# EAGLE design Lap Counter (EAGLE 9.6.2)
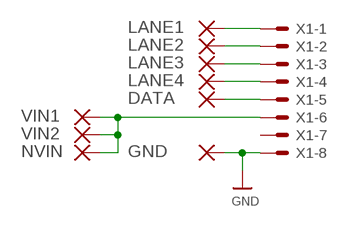
[diagram p0: schematic, sheet 1]

## Parts
DATA  SMD5  [SMD2,54-5,08]
GND  SMD5  [SMD2,54-5,08]
LANE1  SMD5  [SMD2,54-5,08]
LANE2  SMD5  [SMD2,54-5,08]
LANE3  SMD5  [SMD2,54-5,08]
LANE4  SMD5  [SMD2,54-5,08]
NVIN  SMD5  [SMD2,54-5,08]
VIN1  SMD5  [SMD2,54-5,08]
VIN2  SMD5  [SMD2,54-5,08]
X1  KK-156-8  [KK-156-8]

## Nets
DATA: DATA.1(P) X1.5
GND: GND.1(P) X1.8
LANE1: LANE1.1(P) X1.1
LANE2: LANE2.1(P) X1.2
LANE3: LANE3.1(P) X1.3
LANE4: LANE4.1(P) X1.4
VIN: NVIN.1(P) VIN1.1(P) VIN2.1(P) X1.6
Unconnected: X1.7

## Library data of the parts
DATA GND LANE1-LANE4 NVIN VIN1 VIN2 = wirepad:SMD5: SMD PAD
X1 = con-molex:KK-156-8: KK 156 HEADER Source: http://www.molex.com/pdm_docs/sd/026604100_sd.pdf; MF: MOLEX; OC_FARNELL: unknown; OC_NEWARK: unknown

## Board
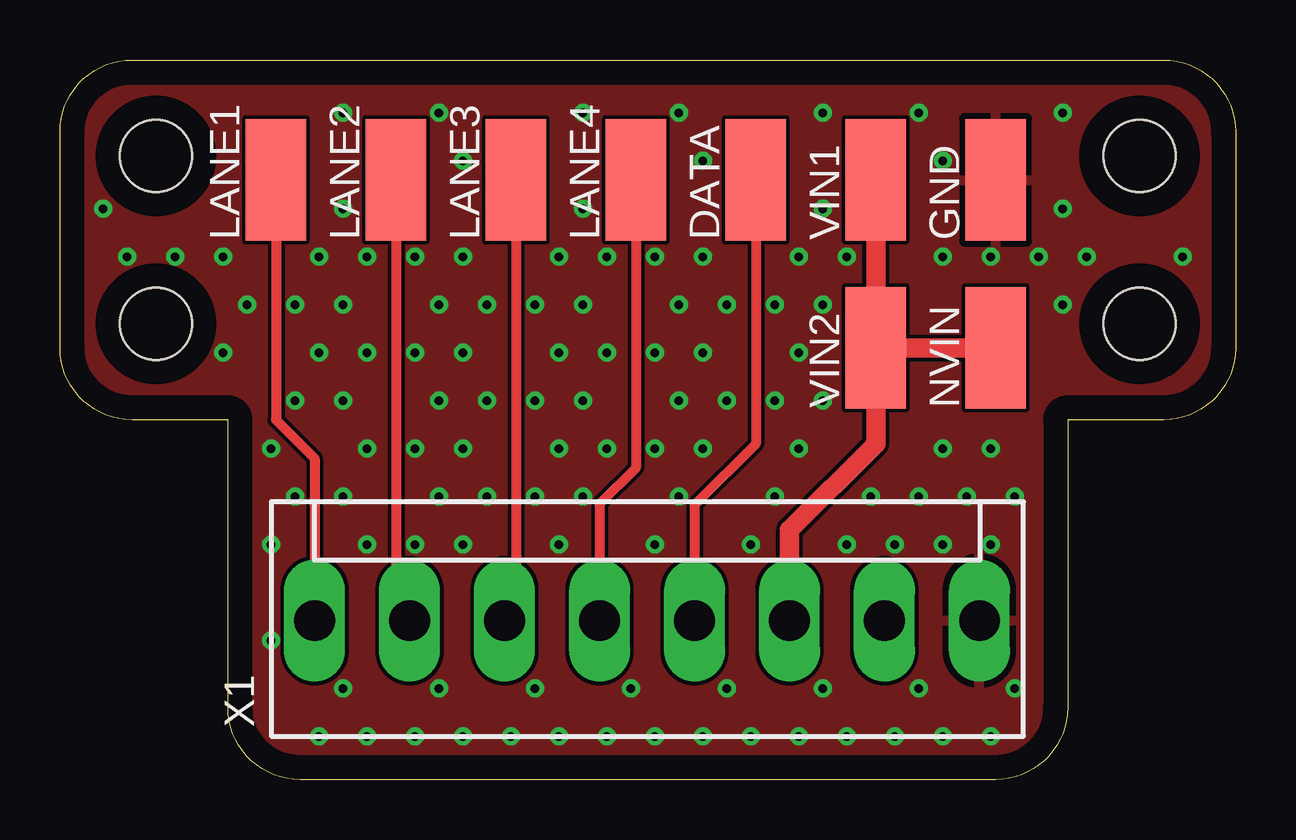
[diagram p1: board, top side]
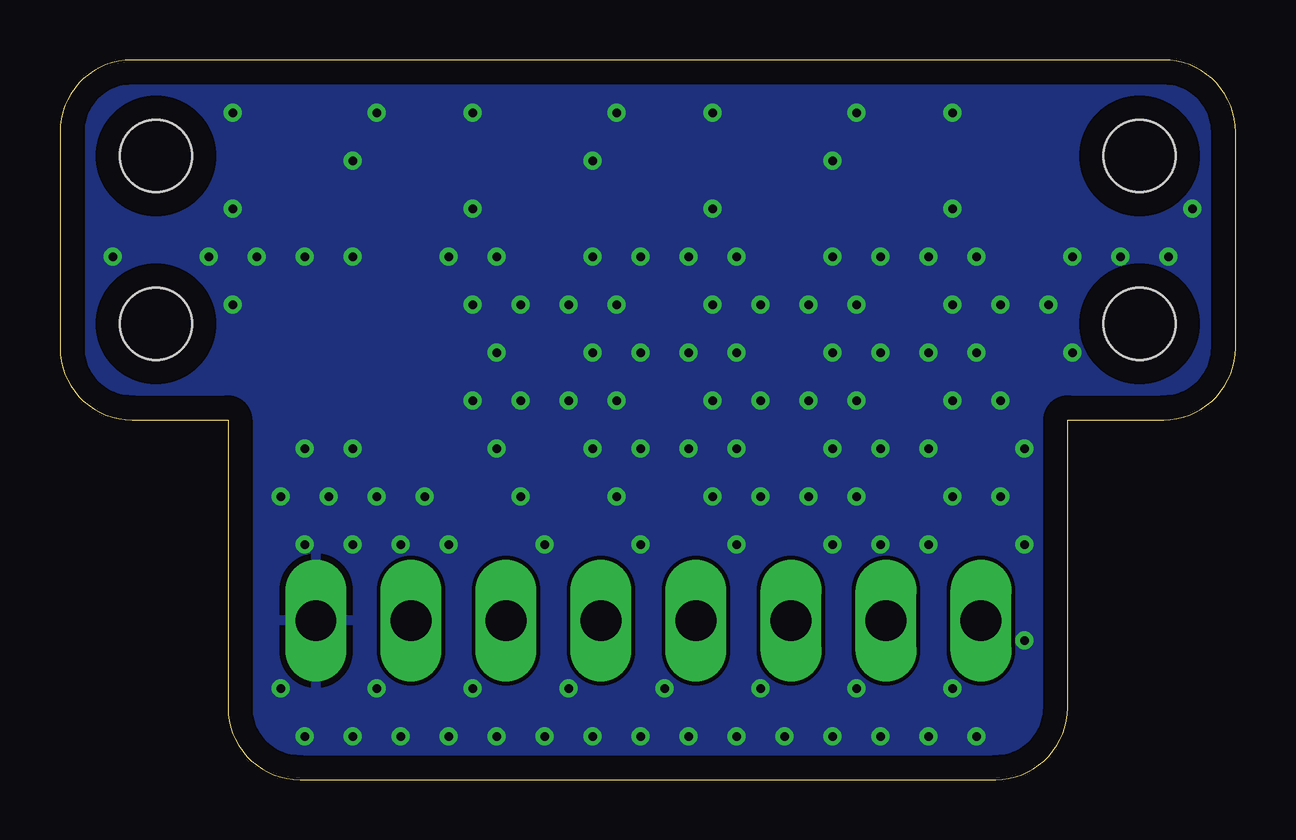
[diagram p2: board, bottom side, seen from below]

Size 49 x 30 mm. Coordinates in mm from the lower left corner, seen from the top.
Outline: 7,15 3,15 arc-90 0,18 0,27 arc-90 3,30 46,30 arc-90 49,27 49,18 arc-90 46,15 42,15 42,3 arc-90 39,0 10,0 arc-90 7,3 7,15
Copper layers (1*16): Top 0.035mm / dielectric 1.5mm / Bottom 0.035mm
Design rules "default": minimum track width 6mil, minimum drill 0.35mm, track to track 6mil, track to pad 6mil, pad to pad 6mil, via to via 6mil, smd to smd 6mil, copper to edge 40mil, drill to drill 6mil, minimum pad ring 10mil, minimum via ring 8mil, stop-mask expansion 4mil, vias tented up to drill 0.5mm, thermal gap 10mil
Holes 3 mm at 4,19 45,19 45,26 4,26

### Footprints (pad centres in the part's own frame; a part is rotated, then mirrored left to right if it is on the bottom)
SMD2,54-5,08 = smd 2.54 x 5.08: 1 0,0
KK-156-8 = drill 1.7 pad 2.184 long: 1 -13.86,0; 2 -9.9,0; 3 -5.94,0; 4 -1.98,0; 5 1.98,0; 6 5.94,0; 7 9.9,0; 8 13.86,0

### Placement (x,y rotation side)
DATA  29,25 0 top
GND  39,25 0 top
LANE1  9,25 0 top
LANE2  14,25 0 top
LANE3  19,25 0 top
LANE4  24,25 0 top
NVIN  39,18 0 top
VIN1  34,25 0 top
VIN2  34,18 0 top
X1  24.47,6.63 0 top

### Tracks (layer width: path | path; a pad name or v marks a point on that pad's centre or on a via)
DATA
  Top 0.406: DATA.1 29,14 26.45,11.45 X1.5
GND  (via drill 0.35)
  other vias: 2.8,21.8 1.8,23.8 4.8,21.8 6.8,17.8 6.8,21.8 8.8,5.8 8.8,9.8 8.8,13.8 7.8,19.8 10.8,1.8 9.8,11.8 9.8,15.8 10.8,17.8 9.8,19.8 10.8,21.8 12.8,1.8 11.8,3.8 12.8,9.8 11.8,11.8 12.8,13.8 11.8,15.8 12.8,17.8 11.8,19.8 12.8,21.8 11.8,23.8 11.8,27.8 14.8,1.8 14.8,9.8 14.8,13.8 14.8,17.8 14.8,21.8 16.8,1.8 15.8,3.8 16.8,9.8 15.8,11.8 16.8,13.8 15.8,15.8 16.8,17.8 15.8,19.8 16.8,21.8 16.8,25.8 15.8,27.8 18.8,1.8 17.8,11.8 17.8,15.8 17.8,19.8 20.8,1.8 19.8,3.8 20.8,9.8 19.8,11.8 20.8,13.8 19.8,15.8 20.8,17.8 19.8,19.8 20.8,21.8 22.8,1.8 21.8,11.8 22.8,13.8 21.8,15.8 22.8,17.8 21.8,19.8 22.8,21.8 21.8,23.8 21.8,27.8 24.8,1.8 23.8,3.8 24.8,9.8 24.8,13.8 24.8,17.8 24.8,21.8 26.8,1.8 25.8,11.8 26.8,13.8 25.8,15.8 26.8,17.8 25.8,19.8 26.8,21.8 26.8,25.8 25.8,27.8 28.8,1.8 27.8,3.8 28.8,9.8 27.8,15.8 27.8,19.8 30.8,1.8 29.8,11.8 30.8,13.8 29.8,15.8 30.8,17.8 29.8,19.8 30.8,21.8 32.8,1.8 31.8,3.8 32.8,9.8 31.8,15.8 31.8,19.8 32.8,21.8 31.8,23.8 31.8,27.8 34.8,1.8 34.8,9.8 33.8,11.8 36.8,1.8 35.8,3.8 36.8,9.8 35.8,11.8 36.8,13.8 36.8,21.8 36.8,25.8 35.8,27.8 38.8,1.8 38.8,9.8 37.8,11.8 38.8,13.8 38.8,21.8 39.8,3.8 39.8,11.8 40.8,21.8 41.8,19.8 42.8,21.8 41.8,23.8 41.8,27.8 46.8,21.8
  pour Top: 0,30 49,30 49,15 42,15 42,0 7,0 7,15 0,15
  pour Bottom: 0,30 49,30 49,15 42,15 42,0 7,0 7,15 0,15
LANE1
  Top 0.406: LANE1.1 9,15 10.61,13.39 X1.1
LANE2
  Top 0.406: LANE2.1 14,7.2 X1.2
LANE3
  Top 0.406: LANE3.1 19,7.1 X1.3
LANE4
  Top 0.406: LANE4.1 24,13 22.49,11.49 X1.4
VIN
  Top 0.813: X1.6 30.41,10.41 34,14 VIN2.1 | VIN2.1 NVIN.1 | VIN2.1 VIN1.1